# EAGLE schematic GNUBLIN_EXTENDED_V1_7 (EAGLE 6.4)

## Sheet 1 of 3
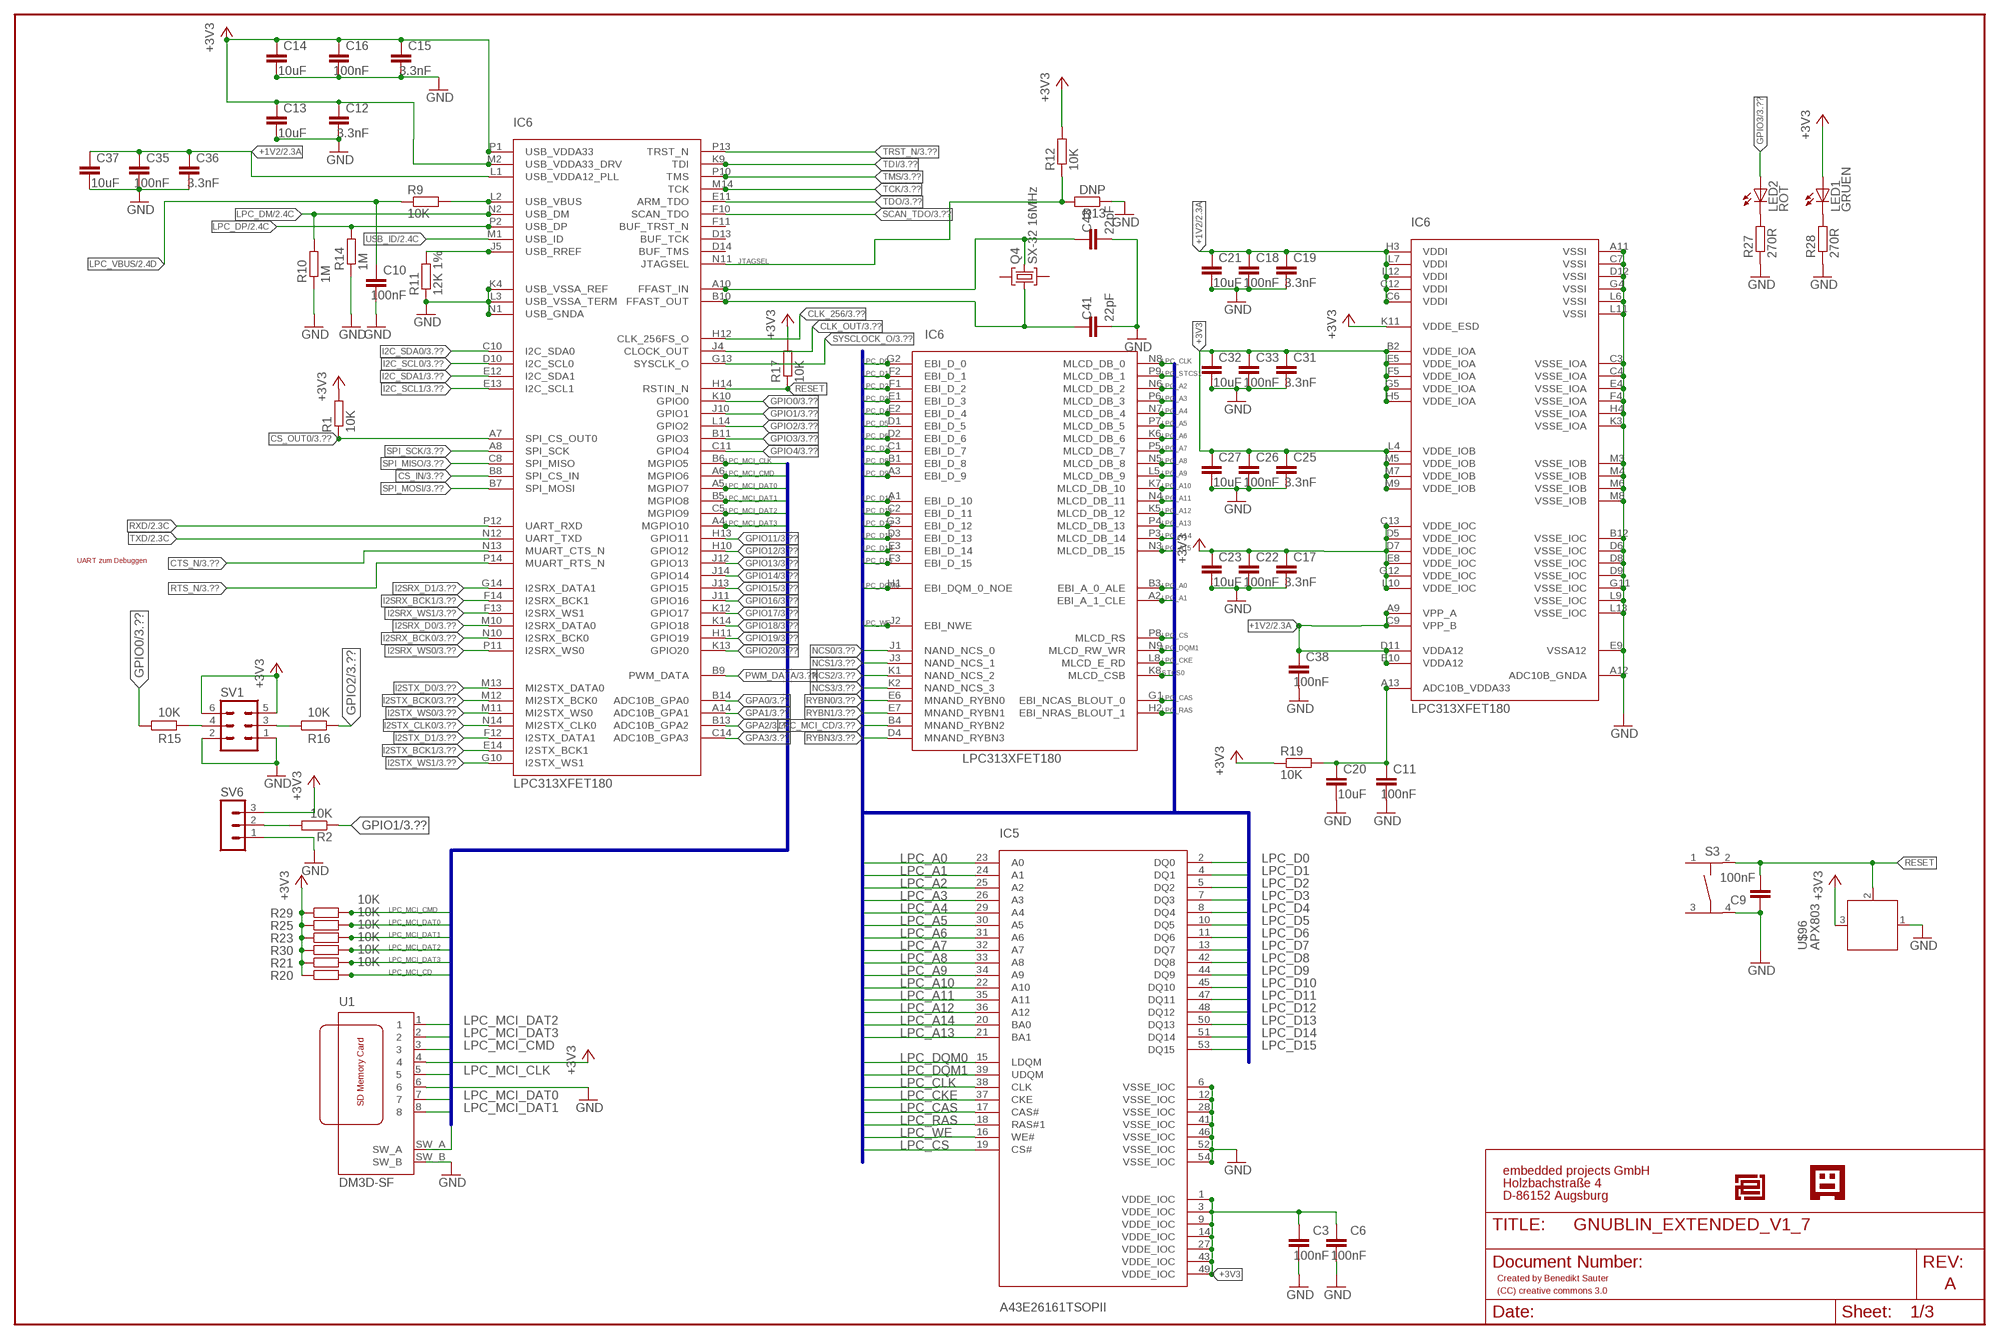
[diagram p0: schematic, sheet 1]

### Parts
C3  100nF  C-EUC0805  [C0805]
C6  100nF  C-EUC0805  [C0805]
C9  100nF  C-EUC0805  [C0805]
C10  100nF  C-EUC0805  [C0805]
C11  100nF  C-EUC0805  [C0805]
C12  3.3nF  C-EUC0805  [C0805]
C13  10uF  C-EUC0805  [C0805]
C14  10uF  C-EUC0805  [C0805]
C15  3.3nF  C-EUC0805  [C0805]
C16  100nF  C-EUC0805  [C0805]
C17  3.3nF  C-EUC0805  [C0805]
C18  100nF  C-EUC0805  [C0805]
C19  3.3nF  C-EUC0805  [C0805]
C20  10uF  C-EUC0805  [C0805]
C21  10uF  C-EUC0805  [C0805]
C22  100nF  C-EUC0805  [C0805]
C23  10uF  C-EUC0805  [C0805]
C25  3.3nF  C-EUC0805  [C0805]
C26  100nF  C-EUC0805  [C0805]
C27  10uF  C-EUC0805  [C0805]
C31  3.3nF  C-EUC0805  [C0805]
C32  10uF  C-EUC0805  [C0805]
C33  100nF  C-EUC0805  [C0805]
C35  100nF  C-EUC0805  [C0805]
C36  3.3nF  C-EUC0805  [C0805]
C37  10uF  C-EUC0805  [C0805]
C38  100nF  C-EUC0805  [C0805]
C41  22pF  C-EUC0805  [C0805]
C43  22pF  C-EUC0805  [C0805]
IC5  A43E26161TSOPII  [TSOPII]
IC6  LPC313XFET180  [TFBGA180]
LED1  GRUEN  LEDCHIP-LED0805  [CHIP-LED0805]
LED2  ROT  LEDCHIP-LED0805  [CHIP-LED0805]
Q4  SX-32 16MHz  SX-32  [SX-32]
R1  10K  R-EU_R0805  [R0805]
R2  10K  R-EU_R0805  [R0805]
R9  10K  R-EU_R0805  [R0805]
R10  1M  R-EU_R0805  [R0805]
R11  12K 1%  R-EU_R0805  [R0805]
R12  10K  R-EU_R0805  [R0805]
R13  DNP  R-EU_R0805  [R0805]
R14  1M  R-EU_R0805  [R0805]
R15  10K  R-EU_R0805  [R0805]
R16  10K  R-EU_R0805  [R0805]
R17  10K  R-EU_R0805  [R0805]
R19  10K  R-EU_R0805  [R0805]
R20  10K  R-EU_R0805  [R0805]
R21  10K  R-EU_R0805  [R0805]
R23  10K  R-EU_R0805  [R0805]
R25  10K  R-EU_R0805  [R0805]
R27  270R  R-EU_R0805  [R0805]
R28  270R  R-EU_R0805  [R0805]
R29  10K  R-EU_R0805  [R0805]
R30  10K  R-EU_R0805  [R0805]
S3  TASTER-9314_SMD  [TASTER-9314_SMD]
SV1  MA03-2  [MA03-2]
SV6  MA03-1  [MA03-1]
U1  DM3D-SF  [DM3D-SF]
U$1  EPLOGOSIEB  [EPLOGOSIEBDRUCK]
U$2  GNUBLINLOGOSIEB  [GNUSIEBDRUCK]
U$96  APX803  [SOT23]

### Nets
+1V2: C18.2 C19.2 C21.2 C35.2 C36.2 C37.2 C38.2 IC6.A9(VPP_A) IC6.C6(VDDI) IC6.C9(VPP_B) IC6.C12(VDDI) IC6.D11(VDDA12) IC6.E10(VDDA12) IC6.H3(VDDI) IC6.L1(USB_VDDA12_PLL) IC6.L7(VDDI) IC6.L12(VDDI) ; also sheet 2
+3V3: C3.2 C6.2 C12.2 C13.2 C14.2 C15.2 C16.2 C17.2 C22.2 C23.2 C25.2 C26.2 C27.2 C31.2 C32.2 C33.2 IC5.1(VDDE_IOC) IC5.3(VDDE_IOC) IC5.9(VDDE_IOC) IC5.14(VDDE_IOC) IC5.27(VDDE_IOC) IC5.43(VDDE_IOC) IC5.49(VDDE_IOC) IC6.B2(VDDE_IOA) IC6.C13(VDDE_IOC) IC6.D5(VDDE_IOC) IC6.D7(VDDE_IOC) IC6.E5(VDDE_IOA) IC6.E8(VDDE_IOC) IC6.F5(VDDE_IOA) IC6.G5(VDDE_IOA) IC6.G12(VDDE_IOC) IC6.H5(VDDE_IOA) IC6.K11(VDDE_ESD) IC6.L4(VDDE_IOB) IC6.L10(VDDE_IOC) IC6.M2(USB_VDDA33_DRV) IC6.M5(VDDE_IOB) IC6.M7(VDDE_IOB) IC6.M9(VDDE_IOB) IC6.P1(USB_VDDA33) LED1.A R1.2 R12.2 R17.2 R19.1 R20.1 R21.1 R23.1 R25.1 R29.1 R30.1 SV1.5 SV1.6 SV6.3 U1.4 U$96.3(VCC) ; also sheet 2,3
CLK_256: IC6.H12(CLK_256FS_O) ; also sheet 3
CLK_OUT: IC6.J4(CLOCK_OUT) ; also sheet 3
CS_IN: IC6.B8(SPI_CS_IN) ; also sheet 3
CS_OUT0: IC6.A7(SPI_CS_OUT0) R1.1 ; also sheet 3
CTS_N: IC6.N13(MUART_CTS_N) ; also sheet 3
GND: C3.1 C6.1 C9.2 C10.1 C11.1 C12.1 C13.1 C14.1 C15.1 C16.1 C17.1 C18.1 C19.1 C20.1 C21.1 C22.1 C23.1 C25.1 C26.1 C27.1 C31.1 C32.1 C33.1 C35.1 C36.1 C37.1 C38.1 C41.1 C43.1 IC5.6(VSSE_IOC) IC5.12(VSSE_IOC) IC5.28(VSSE_IOC) IC5.41(VSSE_IOC) IC5.46(VSSE_IOC) IC5.52(VSSE_IOC) IC5.54(VSSE_IOC) IC6.A11(VSSI) IC6.A12(ADC10B_GNDA) IC6.B12(VSSE_IOC) IC6.C3(VSSE_IOA) IC6.C4(VSSE_IOA) IC6.C7(VSSI) IC6.D6(VSSE_IOC) IC6.D8(VSSE_IOC) IC6.D9(VSSE_IOC) IC6.D12(VSSI) IC6.E4(VSSE_IOA) IC6.E9(VSSA12) IC6.F4(VSSE_IOA) IC6.G4(VSSI) IC6.G11(VSSE_IOC) IC6.H4(VSSE_IOA) IC6.K3(VSSE_IOA) IC6.K4(USB_VSSA_REF) IC6.L3(USB_VSSA_TERM) IC6.L6(VSSI) IC6.L9(VSSE_IOC) IC6.L11(VSSI) IC6.L13(VSSE_IOC) IC6.M3(VSSE_IOB) IC6.M4(VSSE_IOB) IC6.M6(VSSE_IOB) IC6.M8(VSSE_IOB) IC6.N1(USB_GNDA) R10.1 R11.1 R13.1 R14.1 R27.1 R28.1 S3.4 SV1.1 SV1.2 SV6.1 U1.6 U1.SW_B U$96.1(GND) ; also sheet 2,3
GPA0: IC6.B14(ADC10B_GPA0) ; also sheet 3
GPA1: IC6.A14(ADC10B_GPA1) ; also sheet 3
GPA2: IC6.B13(ADC10B_GPA2) ; also sheet 3
GPA3: IC6.C14(ADC10B_GPA3) ; also sheet 3
GPIO0: IC6.K10(GPIO0) R15.1 ; also sheet 3
GPIO1: IC6.J10(GPIO1) R2.1 ; also sheet 3
GPIO2: IC6.L14(GPIO2) R16.2 ; also sheet 3
GPIO3: IC6.B11(GPIO3) LED2.A ; also sheet 3
GPIO4: IC6.C11(GPIO4) ; also sheet 3
GPIO11: IC6.H13(GPIO11) ; also sheet 3
GPIO12: IC6.H10(GPIO12) ; also sheet 3
GPIO13: IC6.J12(GPIO13) ; also sheet 3
GPIO14: IC6.J14(GPIO14) ; also sheet 3
GPIO15: IC6.J13(GPIO15) ; also sheet 3
GPIO16: IC6.J11(GPIO16) ; also sheet 3
GPIO17: IC6.K12(GPIO17) ; also sheet 3
GPIO18: IC6.K14(GPIO18) ; also sheet 3
GPIO19: IC6.H11(GPIO19) ; also sheet 3
GPIO20: IC6.K13(GPIO20) ; also sheet 3
I2C_SCL0: IC6.D10(I2C_SCL0) ; also sheet 3
I2C_SCL1: IC6.E13(I2C_SCL1) ; also sheet 3
I2C_SDA0: IC6.C10(I2C_SDA0) ; also sheet 3
I2C_SDA1: IC6.E12(I2C_SDA1) ; also sheet 3
I2SRX_BCK0: IC6.N10(I2SRX_BCK0) ; also sheet 3
I2SRX_BCK1: IC6.F14(I2SRX_BCK1) ; also sheet 3
I2SRX_D0: IC6.M10(I2SRX_DATA0) ; also sheet 3
I2SRX_D1: IC6.G14(I2SRX_DATA1) ; also sheet 3
I2SRX_WS0: IC6.P11(I2SRX_WS0) ; also sheet 3
I2SRX_WS1: IC6.F13(I2SRX_WS1) ; also sheet 3
I2STX_BCK0: IC6.M12(MI2STX_BCK0) ; also sheet 3
I2STX_BCK1: IC6.E14(I2STX_BCK1) ; also sheet 3
I2STX_CLK0: IC6.N14(MI2STX_CLK0) ; also sheet 3
I2STX_D0: IC6.M13(MI2STX_DATA0) ; also sheet 3
I2STX_D1: IC6.F12(I2STX_DATA1) ; also sheet 3
I2STX_WS0: IC6.M11(MI2STX_WS0) ; also sheet 3
I2STX_WS1: IC6.G10(I2STX_WS1) ; also sheet 3
IO0: R15.2 SV1.4
IO2: R16.1 SV1.3
JTAGSEL: IC6.N11(JTAGSEL) R12.1 R13.2
LPC_A0: IC5.23(A0) IC6.B3(EBI_A_0_ALE) ; also sheet 3
LPC_A1: IC5.24(A1) IC6.A2(EBI_A_1_CLE) ; also sheet 3
LPC_A2: IC5.25(A2) IC6.N6(MLCD_DB_2) ; also sheet 3
LPC_A3: IC5.26(A3) IC6.P6(MLCD_DB_3) ; also sheet 3
LPC_A4: IC5.29(A4) IC6.N7(MLCD_DB_4) ; also sheet 3
LPC_A5: IC5.30(A5) IC6.P7(MLCD_DB_5) ; also sheet 3
LPC_A6: IC5.31(A6) IC6.K6(MLCD_DB_6) ; also sheet 3
LPC_A7: IC5.32(A7) IC6.P5(MLCD_DB_7) ; also sheet 3
LPC_A8: IC5.33(A8) IC6.N5(MLCD_DB_8) ; also sheet 3
LPC_A9: IC5.34(A9) IC6.L5(MLCD_DB_9) ; also sheet 3
LPC_A10: IC5.22(A10) IC6.K7(MLCD_DB_10) ; also sheet 3
LPC_A11: IC5.35(A11) IC6.N4(MLCD_DB_11) ; also sheet 3
LPC_A12: IC5.36(A12) IC6.K5(MLCD_DB_12) ; also sheet 3
LPC_A13: IC5.21(BA1) IC6.P4(MLCD_DB_13) ; also sheet 3
LPC_A14: IC5.20(BA0) IC6.P3(MLCD_DB_14) ; also sheet 3
LPC_A15: IC6.N3(MLCD_DB_15) ; also sheet 3
LPC_CAS: IC5.17(CAS#) IC6.G1(EBI_NCAS_BLOUT_0)
LPC_CKE: IC5.37(CKE) IC6.L8(MLCD_E_RD) ; also sheet 3
LPC_CLK: IC5.38(CLK) IC6.N8(MLCD_DB_0)
LPC_CS: IC5.19(CS#) IC6.P8(MLCD_RS) ; also sheet 3
LPC_D0: IC5.2(DQ0) IC6.G2(EBI_D_0) ; also sheet 3
LPC_D1: IC5.4(DQ1) IC6.F2(EBI_D_1) ; also sheet 3
LPC_D2: IC5.5(DQ2) IC6.F1(EBI_D_2) ; also sheet 3
LPC_D3: IC5.7(DQ3) IC6.E1(EBI_D_3) ; also sheet 3
LPC_D4: IC5.8(DQ4) IC6.E2(EBI_D_4) ; also sheet 3
LPC_D5: IC5.10(DQ5) IC6.D1(EBI_D_5) ; also sheet 3
LPC_D6: IC5.11(DQ6) IC6.D2(EBI_D_6) ; also sheet 3
LPC_D7: IC5.13(DQ7) IC6.C1(EBI_D_7) ; also sheet 3
LPC_D8: IC5.42(DQ8) IC6.B1(EBI_D_8) ; also sheet 3
LPC_D9: IC5.44(DQ9) IC6.A3(EBI_D_9) ; also sheet 3
LPC_D10: IC5.45(DQ10) IC6.A1(EBI_D_10) ; also sheet 3
LPC_D11: IC5.47(DQ11) IC6.C2(EBI_D_11) ; also sheet 3
LPC_D12: IC5.48(DQ12) IC6.G3(EBI_D_12) ; also sheet 3
LPC_D13: IC5.50(DQ13) IC6.D3(EBI_D_13) ; also sheet 3
LPC_D14: IC5.51(DQ14) IC6.E3(EBI_D_14) ; also sheet 3
LPC_D15: IC5.53(DQ15) IC6.F3(EBI_D_15) ; also sheet 3
LPC_DM: IC6.N2(USB_DM) R10.2 ; also sheet 2
LPC_DP: IC6.P2(USB_DP) R14.2 ; also sheet 2
LPC_DQM0: IC5.15(LDQM) IC6.H1(EBI_DQM_0_NOE) ; also sheet 3
LPC_DQM1: IC5.39(UDQM) IC6.N9(MLCD_RW_WR) ; also sheet 3
LPC_MCI_CD: IC6.B4(MNAND_RYBN2) R20.2 U1.SW_A ; also sheet 3
LPC_MCI_CLK: IC6.B6(MGPIO5) U1.5 ; also sheet 3
LPC_MCI_CMD: IC6.A6(MGPIO6) R29.2 U1.3 ; also sheet 3
LPC_MCI_DAT0: IC6.A5(MGPIO7) R25.2 U1.7 ; also sheet 3
LPC_MCI_DAT1: IC6.B5(MGPIO8) R23.2 U1.8 ; also sheet 3
LPC_MCI_DAT2: IC6.C5(MGPIO9) R30.2 U1.1 ; also sheet 3
LPC_MCI_DAT3: IC6.A4(MGPIO10) R21.2 U1.2 ; also sheet 3
LPC_RAS: IC5.18(RAS#1) IC6.H2(EBI_NRAS_BLOUT_1)
LPC_STCS1: IC6.P9(MLCD_DB_1)
LPC_VBUS: C10.2 R9.1 ; also sheet 2
LPC_WE: IC5.16(WE#) IC6.J2(EBI_NWE) ; also sheet 3
N$3: LED2.C R27.2
N$6: R2.2 SV6.2
N$7: LED1.C R28.2
N$44: C11.2 C20.2 IC6.A13(ADC10B_VDDA33) R19.2
N$54: IC6.J5(USB_RREF) R11.2
N$57: IC6.L2(USB_VBUS) R9.2
NCS0: IC6.J1(NAND_NCS_0) ; also sheet 3
NCS1: IC6.J3(NAND_NCS_1) ; also sheet 3
NCS2: IC6.K1(NAND_NCS_2) ; also sheet 3
NCS3: IC6.K2(NAND_NCS_3) ; also sheet 3
PWM_DATA: IC6.B9(PWM_DATA) ; also sheet 3
RESET: C9.1 IC6.H14(RSTIN_N) R17.1 S3.2 U$96.2(!RESET)
RTS_N: IC6.P14(MUART_RTS_N) ; also sheet 3
RXD: IC6.P12(UART_RXD) ; also sheet 2,3
RYBN0: IC6.E6(MNAND_RYBN0) ; also sheet 3
RYBN1: IC6.E7(MNAND_RYBN1) ; also sheet 3
RYBN3: IC6.D4(MNAND_RYBN3) ; also sheet 3
SCAN_TDO: IC6.F10(SCAN_TDO) ; also sheet 3
SPI_MISO: IC6.C8(SPI_MISO) ; also sheet 3
SPI_MOSI: IC6.B7(SPI_MOSI) ; also sheet 3
SPI_SCK: IC6.A8(SPI_SCK) ; also sheet 3
STCS0: IC6.K8(MLCD_CSB) ; also sheet 3
SYSCLOCK_O: IC6.G13(SYSCLK_O) ; also sheet 3
TCK: IC6.M14(TCK) ; also sheet 3
TDI: IC6.K9(TDI) ; also sheet 3
TDO: IC6.E11(ARM_TDO) ; also sheet 3
TMS: IC6.P10(TMS) ; also sheet 3
TRST_N: IC6.P13(TRST_N) ; also sheet 3
TXD: IC6.N12(UART_TXD) ; also sheet 2,3
USB_ID: IC6.M1(USB_ID) ; also sheet 2
XTAL1: C43.2 IC6.A10(FFAST_IN) Q4.3
XTAL2: C41.2 IC6.B10(FFAST_OUT) Q4.1
Unconnected: IC6.D13(BUF_TCK) IC6.D14(BUF_TMS) IC6.F11(BUF_TRST_N) Q4.2 Q4.4 S3.1 S3.3

### Buses
B3:LPC_D0,LPC_D1,LPC_D2,LPC_D3,LPC_D4,LPC_D5,LPC_D6,LPC_D7,LPC_D8,LPC_D9,LPC_D10,LPC_D11,LPC_D12,LPC_D13,LPC_D14,LPC_D15,LPC_A0,LPC_A1,LPC_A2,LPC_A3,LPC_A4,LPC_A5,LPC_A6,LPC_A7,LPC_A8,LPC_A9,LPC_A10,LPC_A11,LPC_A12,LPC_A13,LPC_A14,LPC_A15,LPC_CKE,LPC_CS,LPC_DQM1,LPC_CLK,LPC_RAS,LPC_CAS,LPC_DQM0,LPC_WE,STCS0,STCS1
B2:LPC_MCI_CLK,LPC_MCI_CMD,LPC_MCI_DAT0,LPC_MCI_DAT1,LPC_MCI_DAT2,LPC_MCI_DAT3,LPC_MCI_CD,LPC_MCI_WP

### Notes on the sheet
- UART zum Debuggen
- embedded projects GmbH
- Holzbachstraße 4
- D-86152 Augsburg
- Created by Benedikt Sauter
- A
- (CC) creative commons 3.0

## Sheet 2 of 3
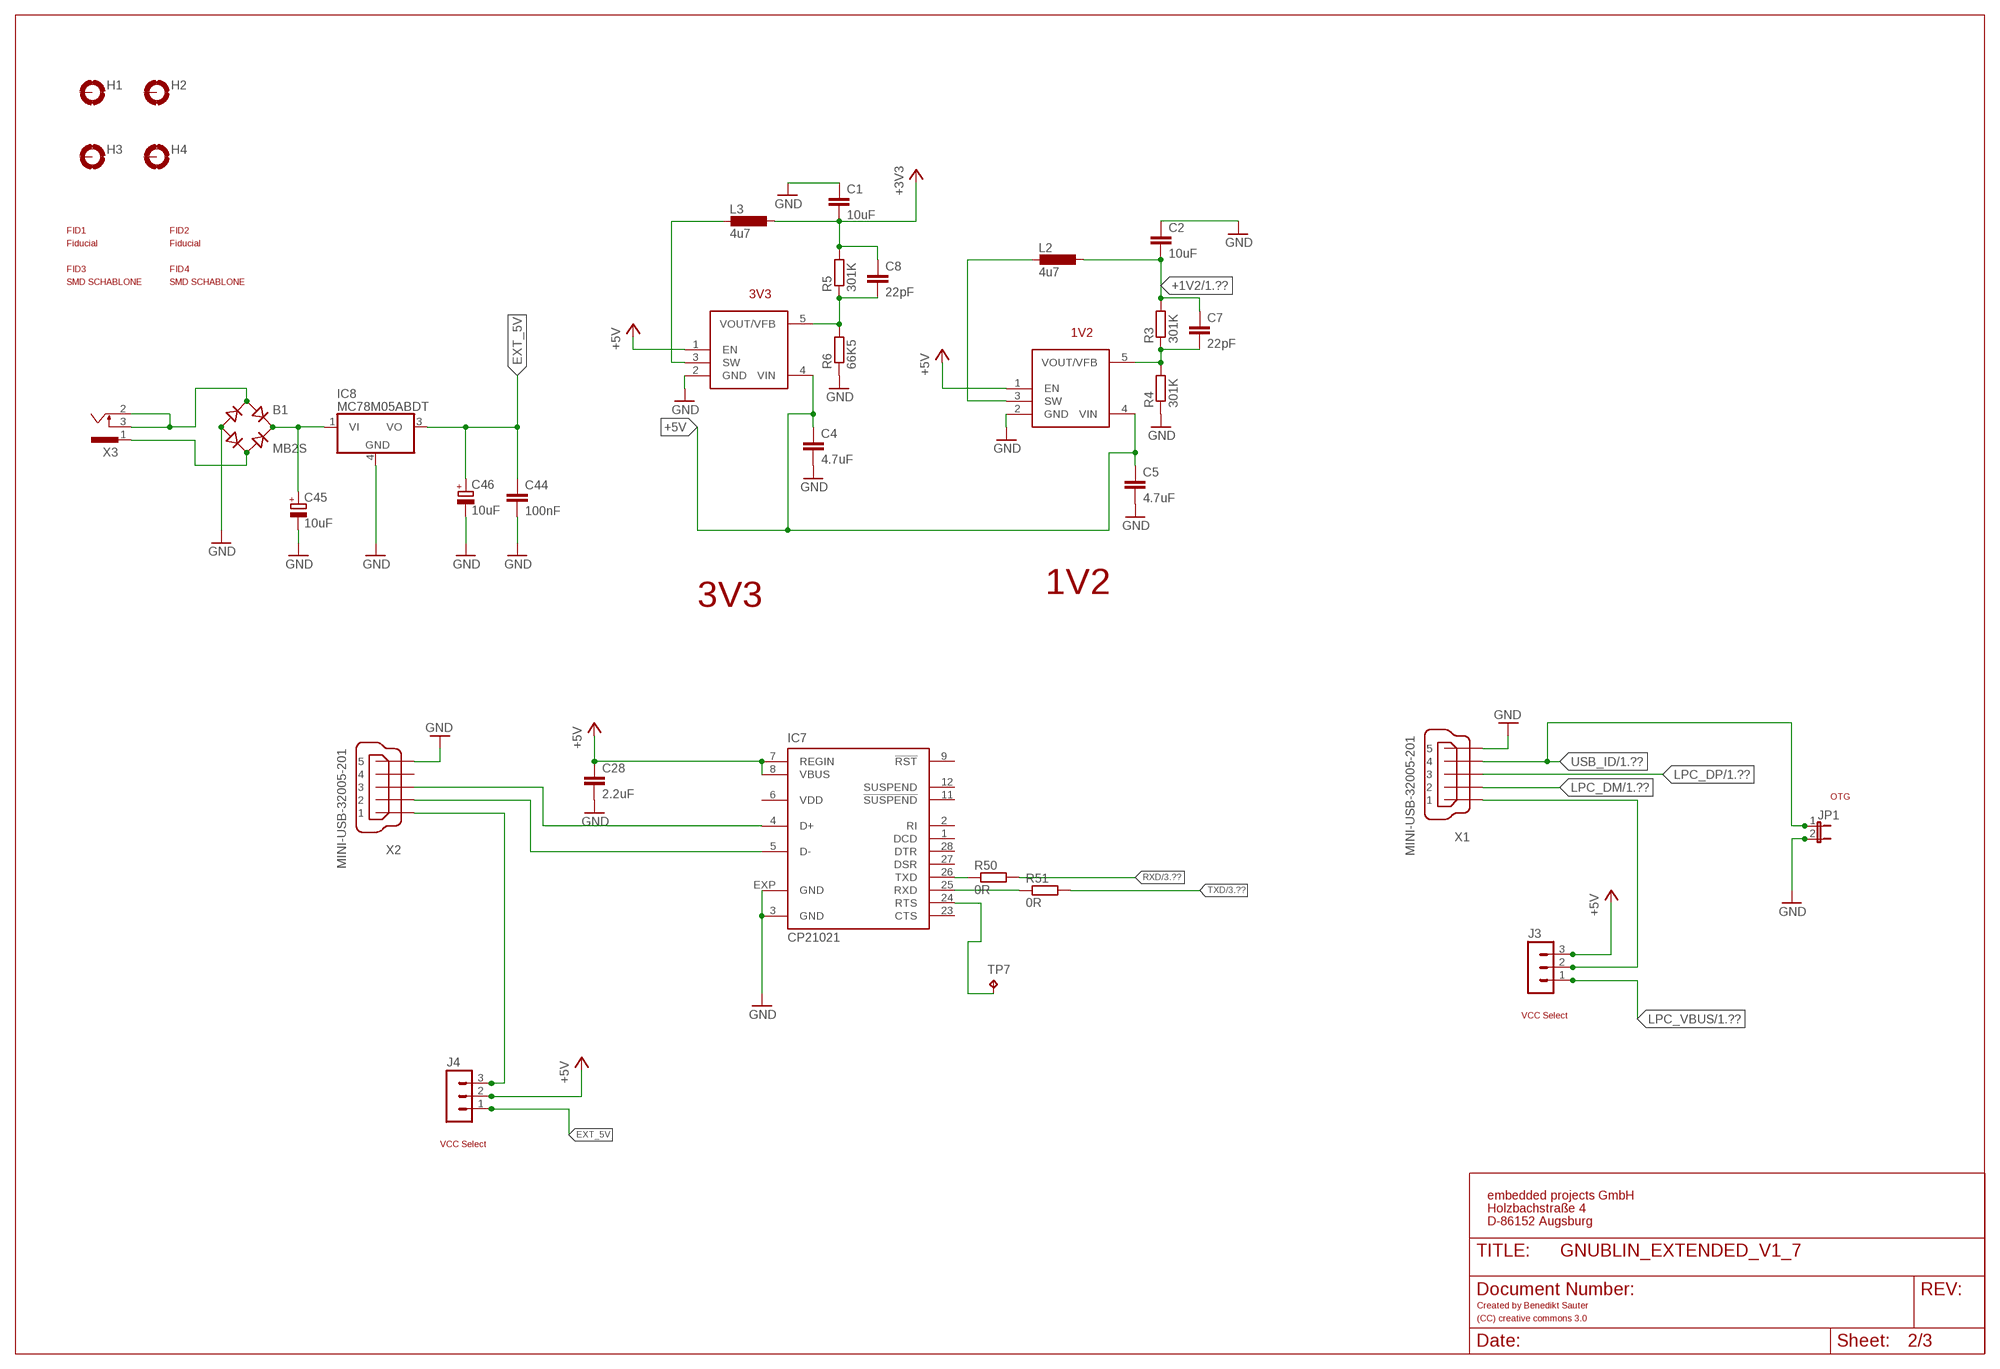
[diagram p1: schematic, sheet 2]

### Parts
B1  MB2S  [SOIC-4]
C1  10uF  C-EUC0805  [C0805]
C2  10uF  C-EUC0805  [C0805]
C4  4.7uF  C-EUC0805  [C0805]
C5  4.7uF  C-EUC0805  [C0805]
C7  22pF  C-EUC0805  [C0805]
C8  22pF  C-EUC0805  [C0805]
C28  2.2uF  C-EUC0805  [C0805]
C44  100nF  C-EUC0805  [C0805]
C45  10uF  CPOL-EUD/7343-31R  [D/7343-31R]
C46  10uF  CPOL-EUD/7343-31R  [D/7343-31R]
FID1  PASSERMARKEN_FIDUCIAL  [PASSERMARKEN_FIDUCIAL]
FID2  PASSERMARKEN_FIDUCIAL  [PASSERMARKEN_FIDUCIAL]
FID3  PASSERMARKEN_FIDUCIAL  [PASSERMARKEN_FIDUCIAL]
FID4  PASSERMARKEN_FIDUCIAL  [PASSERMARKEN_FIDUCIAL]
H1  MOUNT-PAD-ROUND2.8  [2,8-PAD]
H2  MOUNT-PAD-ROUND2.8  [2,8-PAD]
H3  MOUNT-PAD-ROUND2.8  [2,8-PAD]
H4  MOUNT-PAD-ROUND2.8  [2,8-PAD]
IC2  AS1324  [TSOT23]
IC3  AS1324  [TSOT23]
IC7  CP21021  [MLP28]
IC8  MC78M05ABDT  [DPACK_3]
J3  MA03-1  [MA03-1]
J4  MA03-1  [MA03-1]
JP1  JP1E  [JP1]
L2  4u7  PSU3014  [PSU3014]
L3  4u7  PSU3014  [PSU3014]
R3  301K  R-EU_R0805  [R0805]
R4  301K  R-EU_R0805  [R0805]
R5  301K  R-EU_R0805  [R0805]
R6  66K5  R-EU_R0805  [R0805]
R50  0R  R-EU_R0805  [R0805]
R51  0R  R-EU_R0805  [R0805]
TP7  TPTP08R  [TP08R]
X1  MINI-USB-32005-201  [32005-201]
X2  MINI-USB-32005-201  [32005-201]
X3  733980-62  [733980-62]

### Nets
5V_USB: J4.3 X2.1
+1V2: C2.2 C7.1 L2.2 R3.2 ; also sheet 1
+3V3: C1.2 C8.1 L3.2 R5.2 ; also sheet 1,3
+5V: C4.1 C5.1 C28.1 IC2.1(EN) IC2.4(VIN) IC3.1(EN) IC3.4(VIN) IC7.7(REGIN) IC7.8(VBUS) J3.3 J4.2 ; also sheet 3
EXT_5V: C44.1 C46.+ IC8.3(VO) J4.1
GND: B1.- C1.1 C2.1 C4.2 C5.2 C28.2 C44.2 C45.- C46.- IC2.2(GND) IC3.2(GND) IC7.3(GND) IC7.EXP(GND) IC8.4(GND) JP1.2 R4.1 R6.1 X1.5 X2.5 ; also sheet 1,3
LPC_DM: X1.2 ; also sheet 1
LPC_DP: X1.3 ; also sheet 1
LPC_VBUS: J3.1 ; also sheet 1
N$1: IC7.26(TXD) R50.1
N$2: J3.2 X1.1
N$4: IC7.4(D+) X2.3
N$5: IC7.5(D-) X2.2
N$8: IC2.3(SW) L2.1
N$10: IC7.25(RXD) R51.1
N$23: IC7.24(RTS) TP7.TP
N$38: C7.2 IC2.5(VOUT/VFB) R3.1 R4.2
N$46: B1.+ C45.+ IC8.1(VI)
N$48: B1.~2(AC2) X3.1
N$51: B1.~1(AC1) X3.2 X3.3
N$67: IC3.3(SW) L3.1
N$132: C8.2 IC3.5(VOUT/VFB) R5.1 R6.2
RXD: R50.2 ; also sheet 1,3
TXD: R51.2 ; also sheet 1,3
USB_ID: JP1.1 X1.4 ; also sheet 1
Unconnected: H1.B2,8(MOUNT) H2.B2,8(MOUNT) H3.B2,8(MOUNT) H4.B2,8(MOUNT) IC7.1(DCD) IC7.2(RI) IC7.9(!RST) IC7.11(!SUSPEND) IC7.12(SUSPEND) IC7.23(CTS) IC7.27(DSR) IC7.28(DTR) X2.4

### Notes on the sheet
- 3V3
- 1V2
- 1V2
- 3V3
- OTG
- VCC Select
- VCC Select
- embedded projects GmbH
- Holzbachstraße 4
- D-86152 Augsburg
- Created by Benedikt Sauter
- (CC) creative commons 3.0

## Sheet 3 of 3
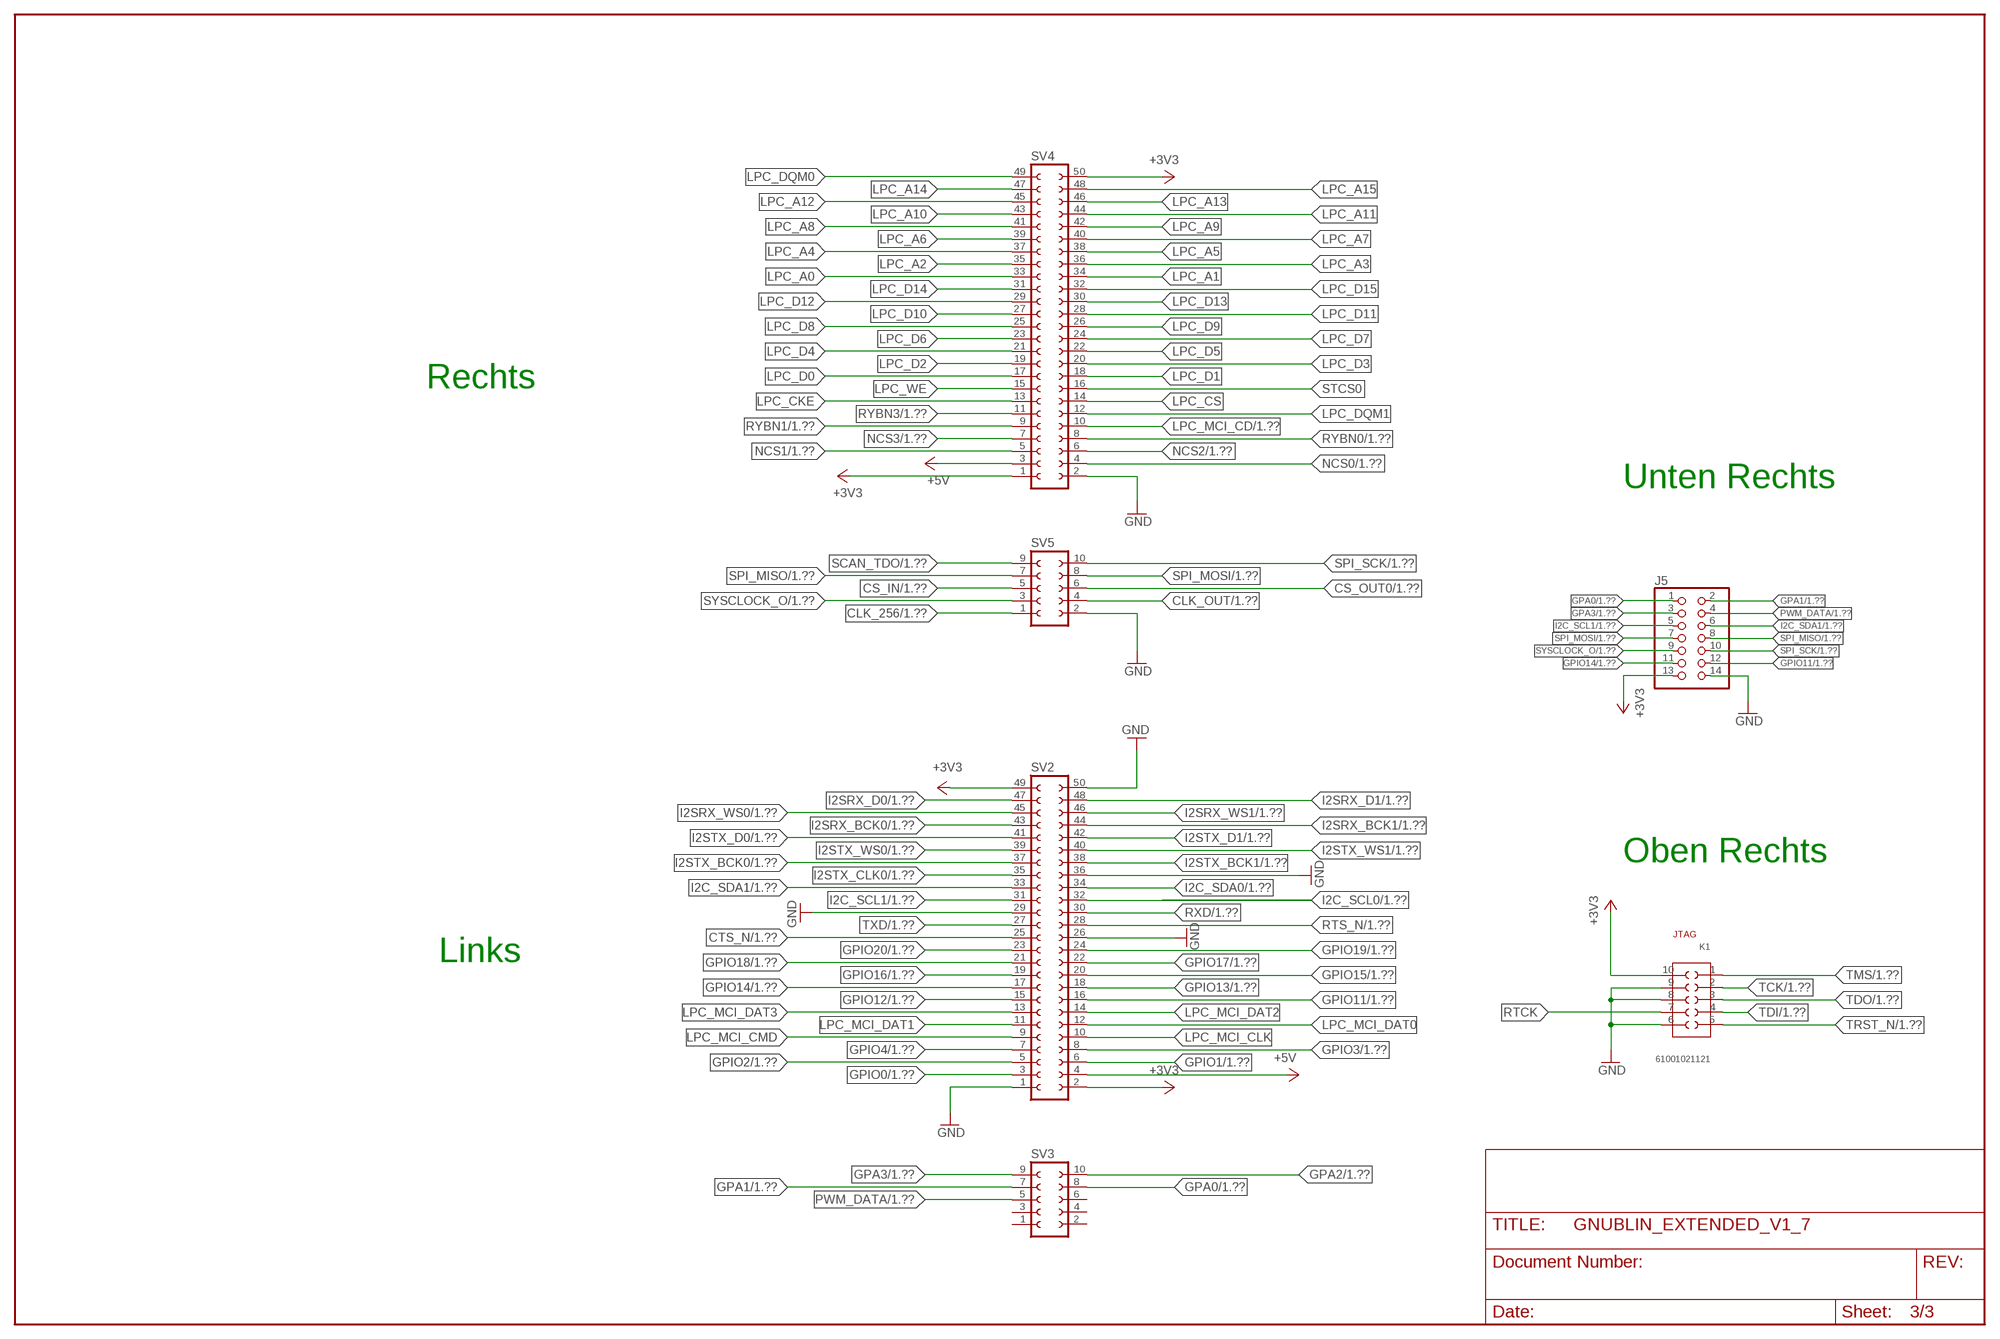
[diagram p2: schematic, sheet 3]

### Parts
J5  PINHD-2X7  [2X07]
K1  61001021121  [61001021121]
SV2  FE25-2  [FE25-2]
SV3  FE05-2  [FE05-2]
SV4  FE25-2  [FE25-2]
SV5  FE05-2  [FE05-2]

### Nets
+3V3: J5.13 K1.10 SV2.2 SV2.49 SV4.1 SV4.50 ; also sheet 1,2
+5V: SV2.4 SV4.3 ; also sheet 2
CLK_256: SV5.1 ; also sheet 1
CLK_OUT: SV5.4 ; also sheet 1
CS_IN: SV5.5 ; also sheet 1
CS_OUT0: SV5.6 ; also sheet 1
CTS_N: SV2.25 ; also sheet 1
GND: J5.14 K1.6 K1.8 K1.9 SV2.1 SV2.26 SV2.29 SV2.36 SV2.50 SV4.2 SV5.2 ; also sheet 1,2
GPA0: J5.1 SV3.8 ; also sheet 1
GPA1: J5.2 SV3.7 ; also sheet 1
GPA2: SV3.10 ; also sheet 1
GPA3: J5.3 SV3.9 ; also sheet 1
GPIO0: SV2.3 ; also sheet 1
GPIO1: SV2.6 ; also sheet 1
GPIO2: SV2.5 ; also sheet 1
GPIO3: SV2.8 ; also sheet 1
GPIO4: SV2.7 ; also sheet 1
GPIO11: J5.12 SV2.16 ; also sheet 1
GPIO12: SV2.15 ; also sheet 1
GPIO13: SV2.18 ; also sheet 1
GPIO14: J5.11 SV2.17 ; also sheet 1
GPIO15: SV2.20 ; also sheet 1
GPIO16: SV2.19 ; also sheet 1
GPIO17: SV2.22 ; also sheet 1
GPIO18: SV2.21 ; also sheet 1
GPIO19: SV2.24 ; also sheet 1
GPIO20: SV2.23 ; also sheet 1
I2C_SCL0: SV2.32 ; also sheet 1
I2C_SCL1: J5.5 SV2.31 ; also sheet 1
I2C_SDA0: SV2.34 ; also sheet 1
I2C_SDA1: J5.6 SV2.33 ; also sheet 1
I2SRX_BCK0: SV2.43 ; also sheet 1
I2SRX_BCK1: SV2.44 ; also sheet 1
I2SRX_D0: SV2.47 ; also sheet 1
I2SRX_D1: SV2.48 ; also sheet 1
I2SRX_WS0: SV2.45 ; also sheet 1
I2SRX_WS1: SV2.46 ; also sheet 1
I2STX_BCK0: SV2.37 ; also sheet 1
I2STX_BCK1: SV2.38 ; also sheet 1
I2STX_CLK0: SV2.35 ; also sheet 1
I2STX_D0: SV2.41 ; also sheet 1
I2STX_D1: SV2.42 ; also sheet 1
I2STX_WS0: SV2.39 ; also sheet 1
I2STX_WS1: SV2.40 ; also sheet 1
LPC_A0: SV4.33 ; also sheet 1
LPC_A1: SV4.34 ; also sheet 1
LPC_A2: SV4.35 ; also sheet 1
LPC_A3: SV4.36 ; also sheet 1
LPC_A4: SV4.37 ; also sheet 1
LPC_A5: SV4.38 ; also sheet 1
LPC_A6: SV4.39 ; also sheet 1
LPC_A7: SV4.40 ; also sheet 1
LPC_A8: SV4.41 ; also sheet 1
LPC_A9: SV4.42 ; also sheet 1
LPC_A10: SV4.43 ; also sheet 1
LPC_A11: SV4.44 ; also sheet 1
LPC_A12: SV4.45 ; also sheet 1
LPC_A13: SV4.46 ; also sheet 1
LPC_A14: SV4.47 ; also sheet 1
LPC_A15: SV4.48 ; also sheet 1
LPC_CKE: SV4.13 ; also sheet 1
LPC_CS: SV4.14 ; also sheet 1
LPC_D0: SV4.17 ; also sheet 1
LPC_D1: SV4.18 ; also sheet 1
LPC_D2: SV4.19 ; also sheet 1
LPC_D3: SV4.20 ; also sheet 1
LPC_D4: SV4.21 ; also sheet 1
LPC_D5: SV4.22 ; also sheet 1
LPC_D6: SV4.23 ; also sheet 1
LPC_D7: SV4.24 ; also sheet 1
LPC_D8: SV4.25 ; also sheet 1
LPC_D9: SV4.26 ; also sheet 1
LPC_D10: SV4.27 ; also sheet 1
LPC_D11: SV4.28 ; also sheet 1
LPC_D12: SV4.29 ; also sheet 1
LPC_D13: SV4.30 ; also sheet 1
LPC_D14: SV4.31 ; also sheet 1
LPC_D15: SV4.32 ; also sheet 1
LPC_DQM0: SV4.49 ; also sheet 1
LPC_DQM1: SV4.12 ; also sheet 1
LPC_MCI_CD: SV4.10 ; also sheet 1
LPC_MCI_CLK: SV2.10 ; also sheet 1
LPC_MCI_CMD: SV2.9 ; also sheet 1
LPC_MCI_DAT0: SV2.12 ; also sheet 1
LPC_MCI_DAT1: SV2.11 ; also sheet 1
LPC_MCI_DAT2: SV2.14 ; also sheet 1
LPC_MCI_DAT3: SV2.13 ; also sheet 1
LPC_WE: SV4.15 ; also sheet 1
NCS0: SV4.4 ; also sheet 1
NCS1: SV4.5 ; also sheet 1
NCS2: SV4.6 ; also sheet 1
NCS3: SV4.7 ; also sheet 1
PWM_DATA: J5.4 SV3.5 ; also sheet 1
RTCK: K1.7
RTS_N: SV2.28 ; also sheet 1
RXD: SV2.30 ; also sheet 1,2
RYBN0: SV4.8 ; also sheet 1
RYBN1: SV4.9 ; also sheet 1
RYBN3: SV4.11 ; also sheet 1
SCAN_TDO: SV5.9 ; also sheet 1
SPI_MISO: J5.8 SV5.7 ; also sheet 1
SPI_MOSI: J5.7 SV5.8 ; also sheet 1
SPI_SCK: J5.10 SV5.10 ; also sheet 1
STCS0: SV4.16 ; also sheet 1
SYSCLOCK_O: J5.9 SV5.3 ; also sheet 1
TCK: K1.2 ; also sheet 1
TDI: K1.4 ; also sheet 1
TDO: K1.3 ; also sheet 1
TMS: K1.1 ; also sheet 1
TRST_N: K1.5 ; also sheet 1
TXD: SV2.27 ; also sheet 1,2
Unconnected: SV3.1 SV3.2 SV3.3 SV3.4 SV3.6

### Notes on the sheet
- Rechts
- Unten Rechts
- Oben Rechts
- JTAG
- Links

## Power pins joined to a net without a drawn wire
VDD: IC7.6(VDD)

## Library data of the parts
B1 = rectifier:MB*S: Bridge Rectifier Source: http://www.fairchildsemi.com/ds/MB/MB6S.pdf
C1-C23 C25-C28 C31-C33 C35-C38 C41 C43 C44 = rcl:C-EU: CAPACITOR, European symbol
C45 C46 = rcl:CPOL-EU: POLARIZED CAPACITOR, European symbol
FID1 FID2 = KUBUS3:PASSERMARKEN_FIDUCIAL: SMD Passermarke
FID3 FID4 = SMDSCHABLONE:PASSERMARKEN_FIDUCIAL: SMD Passermarke
H1-H4 = holes:MOUNT-PAD-ROUND: MOUNTING PAD, round
IC2 IC3 = KUBUS3B_PARTS2:AS1324: DC/DC Step-Down Regulator
IC5 = LPC3131:A43E26161
IC6 = KUBUS3B:LPC313XFET180: lpc313x.lpc314x.tfbga edit this description Auto generated by make-symbol-device-package-bsdl.ulp Rev. 24 Source: lpc313x.lpc314x.tfbga.bsdl
IC7 = CP2102:CP2102: Single-Chip USB to UART Bridge Source: www.silabs.com .. CP2101.pdf / cp2102.pdf; MF: FARNELL; MPN: CP2102-GM; OC_FARNELL: 9282130; OC_NEWARK: 30K5635
IC8 = linear:MC78M: 500 mA Positive Voltage Regulators Source: Data sheet <http://www.onsemi.com/pub_link/Collateral/MC78M00-D.PDF>
J3 J4 SV6 = con-lstb:MA03-1: PIN HEADER; OC_FARNELL: unknown; OC_NEWARK: unknown
J5 = pinhead:PINHD-2X7: PIN HEADER
JP1 = jumper:JP1E: JUMPER
K1 = Wuerth_Elektronik_eiCan_01_Pin__Socked_Headers_v1_3:61001021121: WR-PHD 2.54mm Dual SMT Pin Header, 10 Pins
L2 L3 = KUBUS3B_PARTS2:PSU3014: SMD Power Inductors Shielded
LED1 LED2 = led:LED: LED OSRAM: - CHIPLED LG R971, LG N971, LY N971, LG Q971, LY Q971, LO R971, LY R971 LH N974, LH R974 LS Q976, LO Q976, LY Q976 LO Q996 - Hyper CHIPLED LW Q18S LB Q993, LB Q99A, LB R99A - SideLED LS A670, LO A670, LY A670, LG A670, LP A670 LB A673, LV A673, LT A673, LW A673 LH A674 LY A675 LS A676, LA A676, LO A676, LY A676, LW A676 LS A679, LY A679, LG A679 - Hyper Micro SIDELED® LS Y876, LA Y876, LO Y876, LY Y876 LT Y87S - SmartLED LW L88C, LW L88S LB L89C, LB L89S, LG L890 LS L89K, LO L89K, LY L89K LS L896, LA L896, LO L896, LY L896 - TOPLED LS T670, LO T670, LY T670, LG T670, LP T670 LSG T670, LSP T670, LSY T670, LOP T670, LYG T670 LG T671, LOG T671, LSG T671 LB T673, LV T673, LT T673, LW T673 LH T674 LS T676, LA T676, LO T676, LY T676, LB T676, LH T676, LSB T676, LW T676 LB T67C, LV T67C, LT T67C, LS T67K, LO T67K, LY T67K, LW E67C LS E67B, LA E67B, LO E67B, LY E67B, LB E67C, LV E67C, LT E67C LW T67C LS T679, LY T679, LG T679 LS T770, LO T770, LY T770, LG T770, LP T770 LB T773, LV T773, LT T773, LW T773 LH T774 LS E675, LA E675, LY E675, LS T675 LS T776, LA T776, LO T776, LY T776, LB T776 LHGB T686 LT T68C, LB T68C - Hyper Mini TOPLED® LB M676 - Mini TOPLED Santana® LG M470 LS M47K, LO M47K, LY M47K Source: http://www.osram.convergy.de LUXEON: - LUMILED® LXK2-PW12-R00, LXK2-PW12-S00, LXK2-PW14-U00, LXK2-PW14-V00 LXK2-PM12-R00, LXK2-PM12-S00, LXK2-PM14-U00 LXK2-PE12-Q00, LXK2-PE12-R00, LXK2-PE12-S00, LXK2-PE14-T00, LXK2-PE14-U00 LXK2-PB12-K00, LXK2-PB12-L00, LXK2-PB12-M00, LXK2-PB14-N00, LXK2-PB14-P00, LXK2-PB14-Q00 LXK2-PR12-L00, LXK2-PR12-M00, LXK2-PR14-Q00, LXK2-PR14-R00 LXK2-PD12-Q00, LXK2-PD12-R00, LXK2-PD12-S00 LXK2-PH12-R00, LXK2-PH12-S00 LXK2-PL12-P00, LXK2-PL12-Q00, LXK2-PL12-R00 Source: www.luxeon.com KINGBRIGHT: KA-3528ASYC Source: www.kingbright.com
Q4 = KUBUS3B_PARTS2:SX-32: SMD CRYSTAL; FARNELL: 1712841
R1-R6 R9-R17 R19-R21 R23 R25 R27-R30 R50 R51 = rcl:R-EU_: RESISTOR, European symbol
S3 = Ergaenzung:TASTER-9314_SMD
SV1 = con-lstb:MA03-2: PIN HEADER; OC_FARNELL: unknown; OC_NEWARK: unknown
SV2 SV4 = con-lsta:FE25-2: FEMALE HEADER; OC_FARNELL: unknown; OC_NEWARK: unknown
SV3 SV5 = con-lsta:FE05-2: FEMALE HEADER; OC_FARNELL: unknown; OC_NEWARK: unknown
TP7 = testpad:TP: Test pad
U1 = KUBUS3B_PARTS2:DM3D-SF: MicroSD Card
U$1 = EmbeddedProjectsLogos2:EPLOGO
U$2 = EmbeddedProjectsLogos2:GNUBLINLOGO
U$96 = APX803:APX803
X1 X2 = con-cypressindustries:MINI-USB-: MINI USB-B Conector Source: www.cypressindustries.com
X3 = con-conrad:73398?: FEMALE PRINT CONNECTOR Niedervolt-Steckverbinder Distributor Conrad

## Net classes
0 default: width 0.254 mm, drill 0.7 mm, clearance 0.254 mm
1 500mA: width 0.3 mm, drill 0.3 mm, clearance 0.15 mm